# Altium schematic sheet EECS498Converter.SchDoc
size B; SheetNumber: 1; SheetTotal: 7
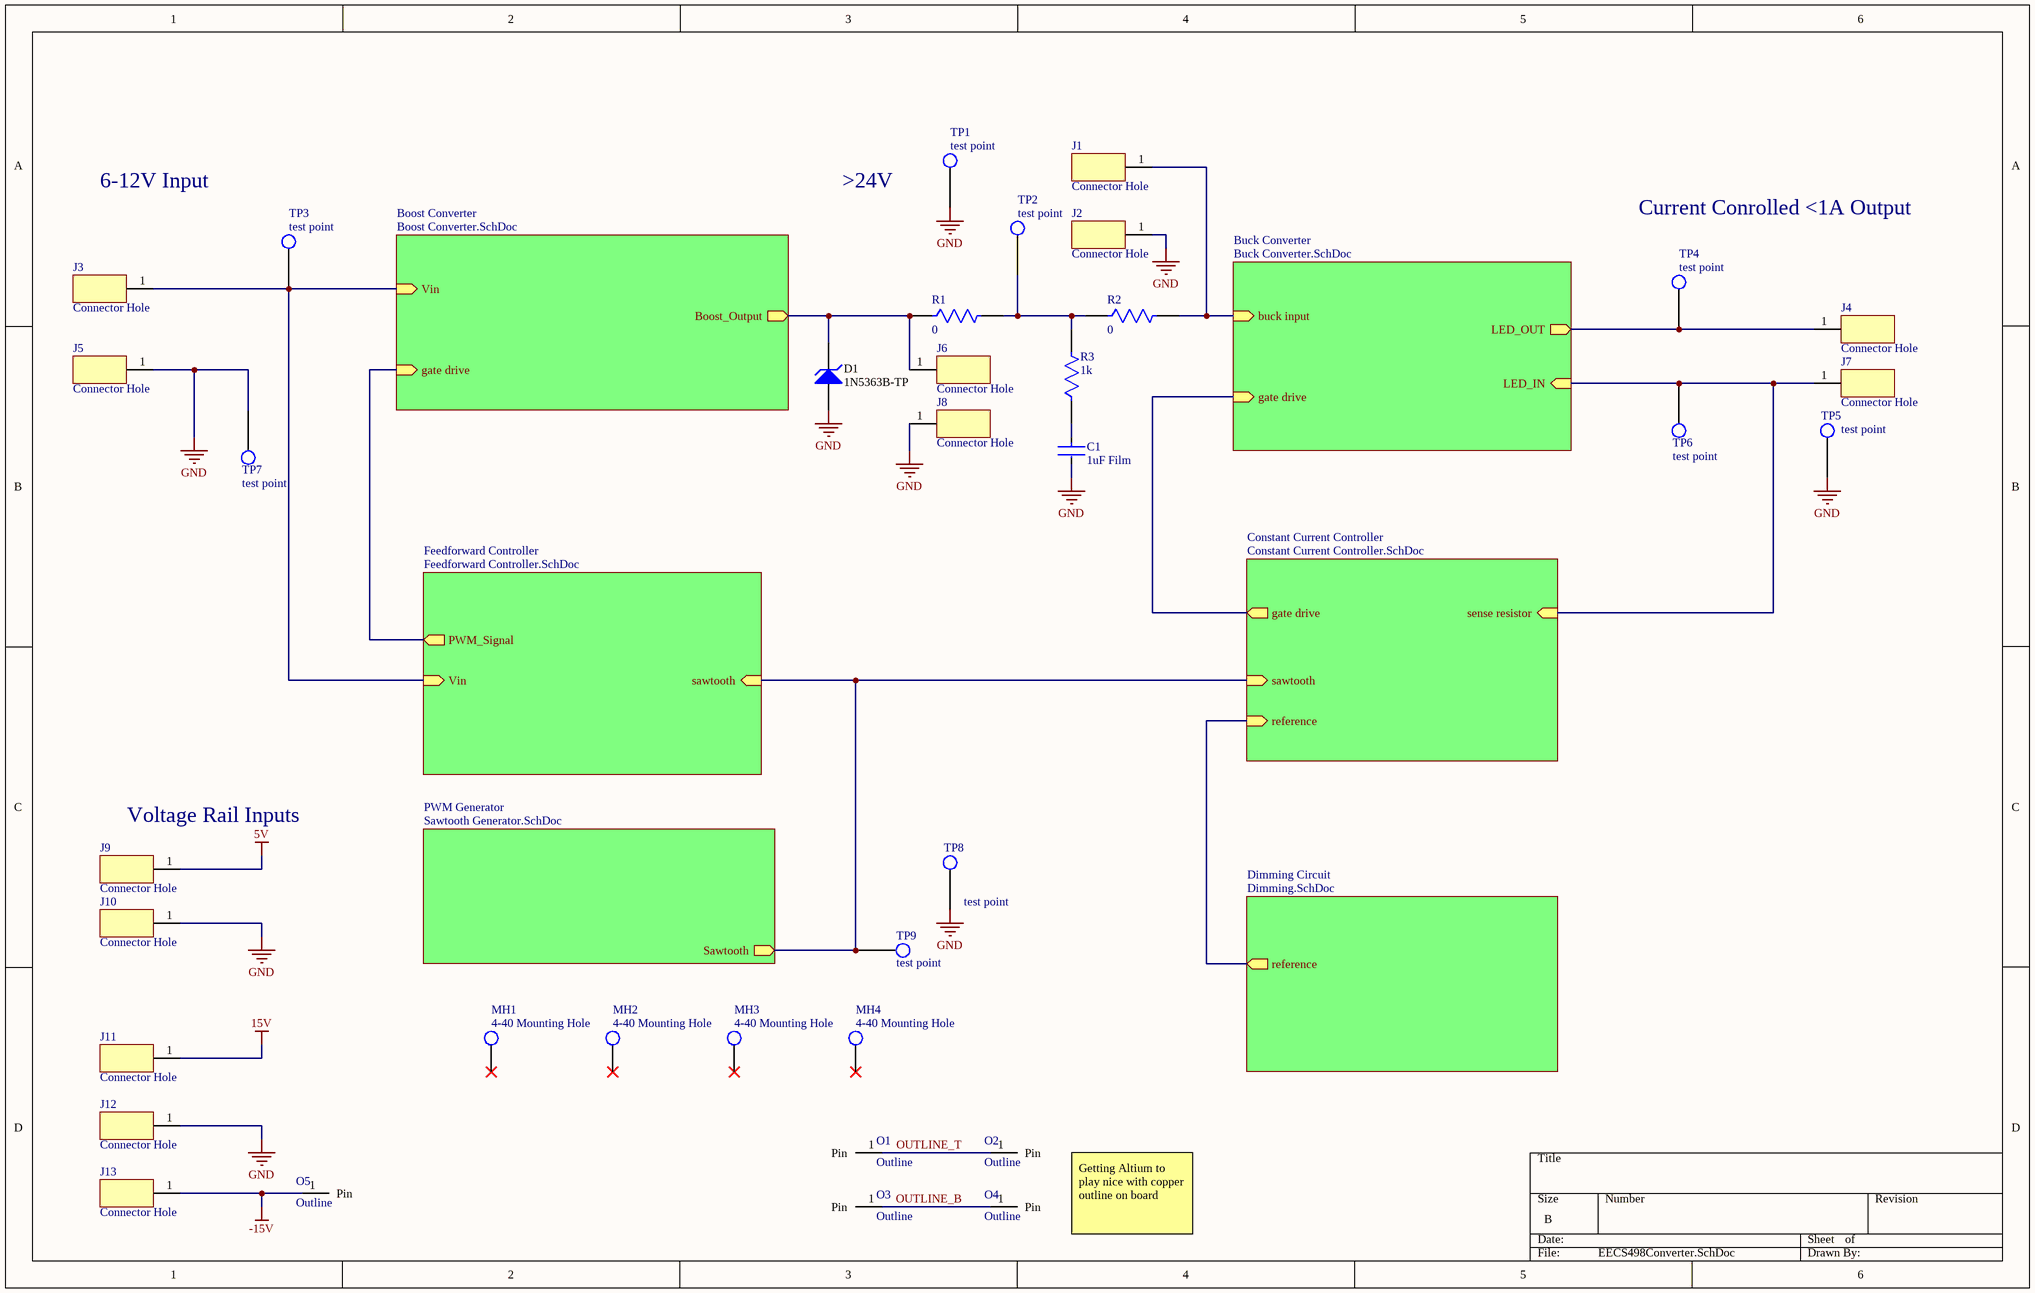
[diagram p0: EECS498Converter.SchDoc]

## Parts
C1  1uF Film  [FP-FILM-CAP-10mm]
D1  1N5363B-TP  [1N5363B-TP]
J1  Connector Hole  [Connector Hole]
J2  Connector Hole  [Connector Hole]
J3  Connector Hole  [Connector Hole]
J4  Connector Hole  [Connector Hole]
J5  Connector Hole  [Connector Hole]
J6  Connector Hole  [Connector Hole]
J7  Connector Hole  [Connector Hole]
J8  Connector Hole  [Connector Hole]
J9  Connector Hole  [Connector Hole]
J10  Connector Hole  [Connector Hole]
J11  Connector Hole  [Connector Hole]
J12  Connector Hole  [Connector Hole]
J13  Connector Hole  [Connector Hole]
MH1  4-40 Mounting Hole  [4-40 Mounting Hole]
MH2  4-40 Mounting Hole  [4-40 Mounting Hole]
MH3  4-40 Mounting Hole  [4-40 Mounting Hole]
MH4  4-40 Mounting Hole  [4-40 Mounting Hole]
O1  Outline
O2  Outline
O3  Outline
O4  Outline
O5  Outline
R1  0  [FP-RLR07-MFG]
R2  0  [FP-RLR07-MFG]
R3  1k  [FP-RLR07-MFG]
TP1  test point  [test point]
TP2  test point  [test point]
TP3  test point  [test point]
TP4  test point  [test point]
TP5  test point  [test point]
TP6  test point  [test point]
TP7  test point  [test point]
TP8  test point  [test point]
TP9  test point  [test point]

## Sub-sheets
Boost Converter = Boost Converter.SchDoc: Vin (in), gate drive (in), Boost_Output (out)
Buck Converter = Buck Converter.SchDoc: buck input (in), gate drive (in), LED_IN (in), LED_OUT (out)
Constant Current Controller = Constant Current Controller.SchDoc: sense resistor (in), gate drive (out), reference (in), sawtooth (in)
Dimming Circuit = Dimming.SchDoc: reference (out)
Feedforward Controller = Feedforward Controller.SchDoc: Vin (in), PWM_Signal (out), sawtooth (in)
PWM Generator = Sawtooth Generator.SchDoc: Sawtooth (out)

## Nets
5V: J9.1
15V: J11.1
-15V: J13.1 O5.1(Pin)
GND: C1.2 D1.1(A) J2.1 J5.1 J8.1 J10.1 J12.1 TP1.1 TP5.1 TP7.1 TP8.1
OUTLINE_B: O3.1(Pin) O4.1(Pin)
OUTLINE_T: O1.1(Pin) O2.1(Pin)
NetC1_1: C1.1 R3.1
NetD1_2: D1.2(K) J6.1 R1.1 ; sheet Boost Converter/Boost_Output
NetJ1_1: J1.1 R2.2 ; sheet Buck Converter/buck input
NetJ3_1: J3.1 TP3.1 ; sheet Boost Converter/Vin, sheet Feedforward Controller/Vin
NetJ4_1: J4.1 TP4.1 ; sheet Buck Converter/LED_OUT
NetJ7_1: J7.1 TP6.1 ; sheet Buck Converter/LED_IN, sheet Constant Current Controller/sense resistor
NetR1_2: R1.2 R2.1 R3.2 TP2.1
NetTP9_1: TP9.1 ; sheet Constant Current Controller/sawtooth, sheet Feedforward Controller/sawtooth, sheet PWM Generator/Sawtooth
(unnamed): sheet Boost Converter/gate drive, sheet Feedforward Controller/PWM_Signal
(unnamed): sheet Buck Converter/gate drive, sheet Constant Current Controller/gate drive
(unnamed): sheet Constant Current Controller/reference, sheet Dimming Circuit/reference

Not connected (* = marked no-connect by the designer): MH1 1*; MH2 1*; MH3 1*; MH4 1*

## Notes on the sheet
- 6-12V Input
- >24V
- Current Conrolled <1A Output
- (near J9) Voltage Rail Inputs
- Getting Altium to play nice with copper outline on board

## Library data of the parts
C1 = 1uf Capacitor: CAP CER 1UF 50V X7R FILM; Capacitance: 100nF; Tolerance: 10%; Dielectric Material: Ceramic; Lead Length: 30mm; Lead Diameter: 0.5mm; Lead/Base Style: Formed Leads; Diameter: 500um; Max Operating Temperature: 125°C; Case/Package: Dipped; Dielectric: X7R; Lead Free: Lead Free; Construction: RADIAL; Voltage: 50V; Thickness: 2.6mm; Min Operating Temperature: -55°C; Lead Pitch: 5mm; Height: 4mm; Radiation Hardening: No; Voltage Rating: 50V; Depth: 2.5mm; Voltage Rating (DC): 50V; Package Quantity: 1; Weight: 0.005644oz; Series: K; Mount: Through Hole; Termination: Radial; Height - Seated (Max): 0.257inch; Length: 4mm; Packaging: Tape and Reel; Width: 2.5mm; RoHS Compliant: Yes
D1 = 1N5363B-TP: Zener Diode 30V 5W THT; PartNumber: 1N4742A; Manufacturer: Fairchild Semiconductor; Tolerance: 5%; PD (W): 1; VZ (Min.) (V): 11.4; VZ (Max.) (V): 12.6; ZZ (Max) (ohm): 8; IR (uA): 5; Test Current IZ (mA): 21; PackageVersion: Rev. 2; DatasheetVersion: Rev. H3; Mounting Technology: Through Hole; PackageDescription: 2-Pin Axial leaded, Body 2.72 x 5.2 mm, Lead Spread 25.4 mm; ComponentLink1Description: Manufacturer URL; ComponentLink3Description: Package Specification; ComponentLink2Description: Datasheet; ComponentLink2URL: http://www.fairchildsemi.com/ds/1N/1N4744A.pdf; PackageReference: DO-41-2; RoHS: TRUE; Operating and Storage Temperature Range: -65 to 200 degC; ComponentLink3URL: http://www.fairchildsemi.com/dwg/DO/DO41A.pdf; ComponentLink1URL: http://www.fairchildsemi.com/
R1-R3 = Resistor: Resistor, ± 1%, 250 mW, Axial Leaded, Metal Film, Military Reliability; NexarPartId: 39453770; Max Power Dissipation: 250mW; Resistance: 100kΩ; Lead Length: 38.1mm; Voltage Rating: 250V; Lead Diameter: 640µm; Temperature Coefficient: 100ppm/°C; Wire/Cable Diameter: 50.8µm; Military Standard: MIL-PRF-39017; REACH SVHC: Unknown; Min Operating Temperature: -65°C; Length: 7.62mm; Case/Package: Axial; Lead Free: Contains Lead; Height: 2.5mm; Contact Plating: Lead, Tin; Radiation Hardening: No; Composition: Metal Film; Voltage Rating (DC): 250V; Schedule B: 8533210090, 8533210090|8533210090, 8533210090|8533210090|8533210090, 8533210090|8533210090|8533210090|8533210090; Diameter: 2.29mm; Tolerance: 1%; Max Operating Temperature: 150°C; Number of Terminations: 2; RoHS: Non-Compliant; Features: Military, Moisture Resistant, Weldable; Power Rating: 250mW; Packaging: Bulk; Width: 2.29mm; Termination: Axial; Failure Rate: 0.001%